# Altium project buck-boost.PrjPcb
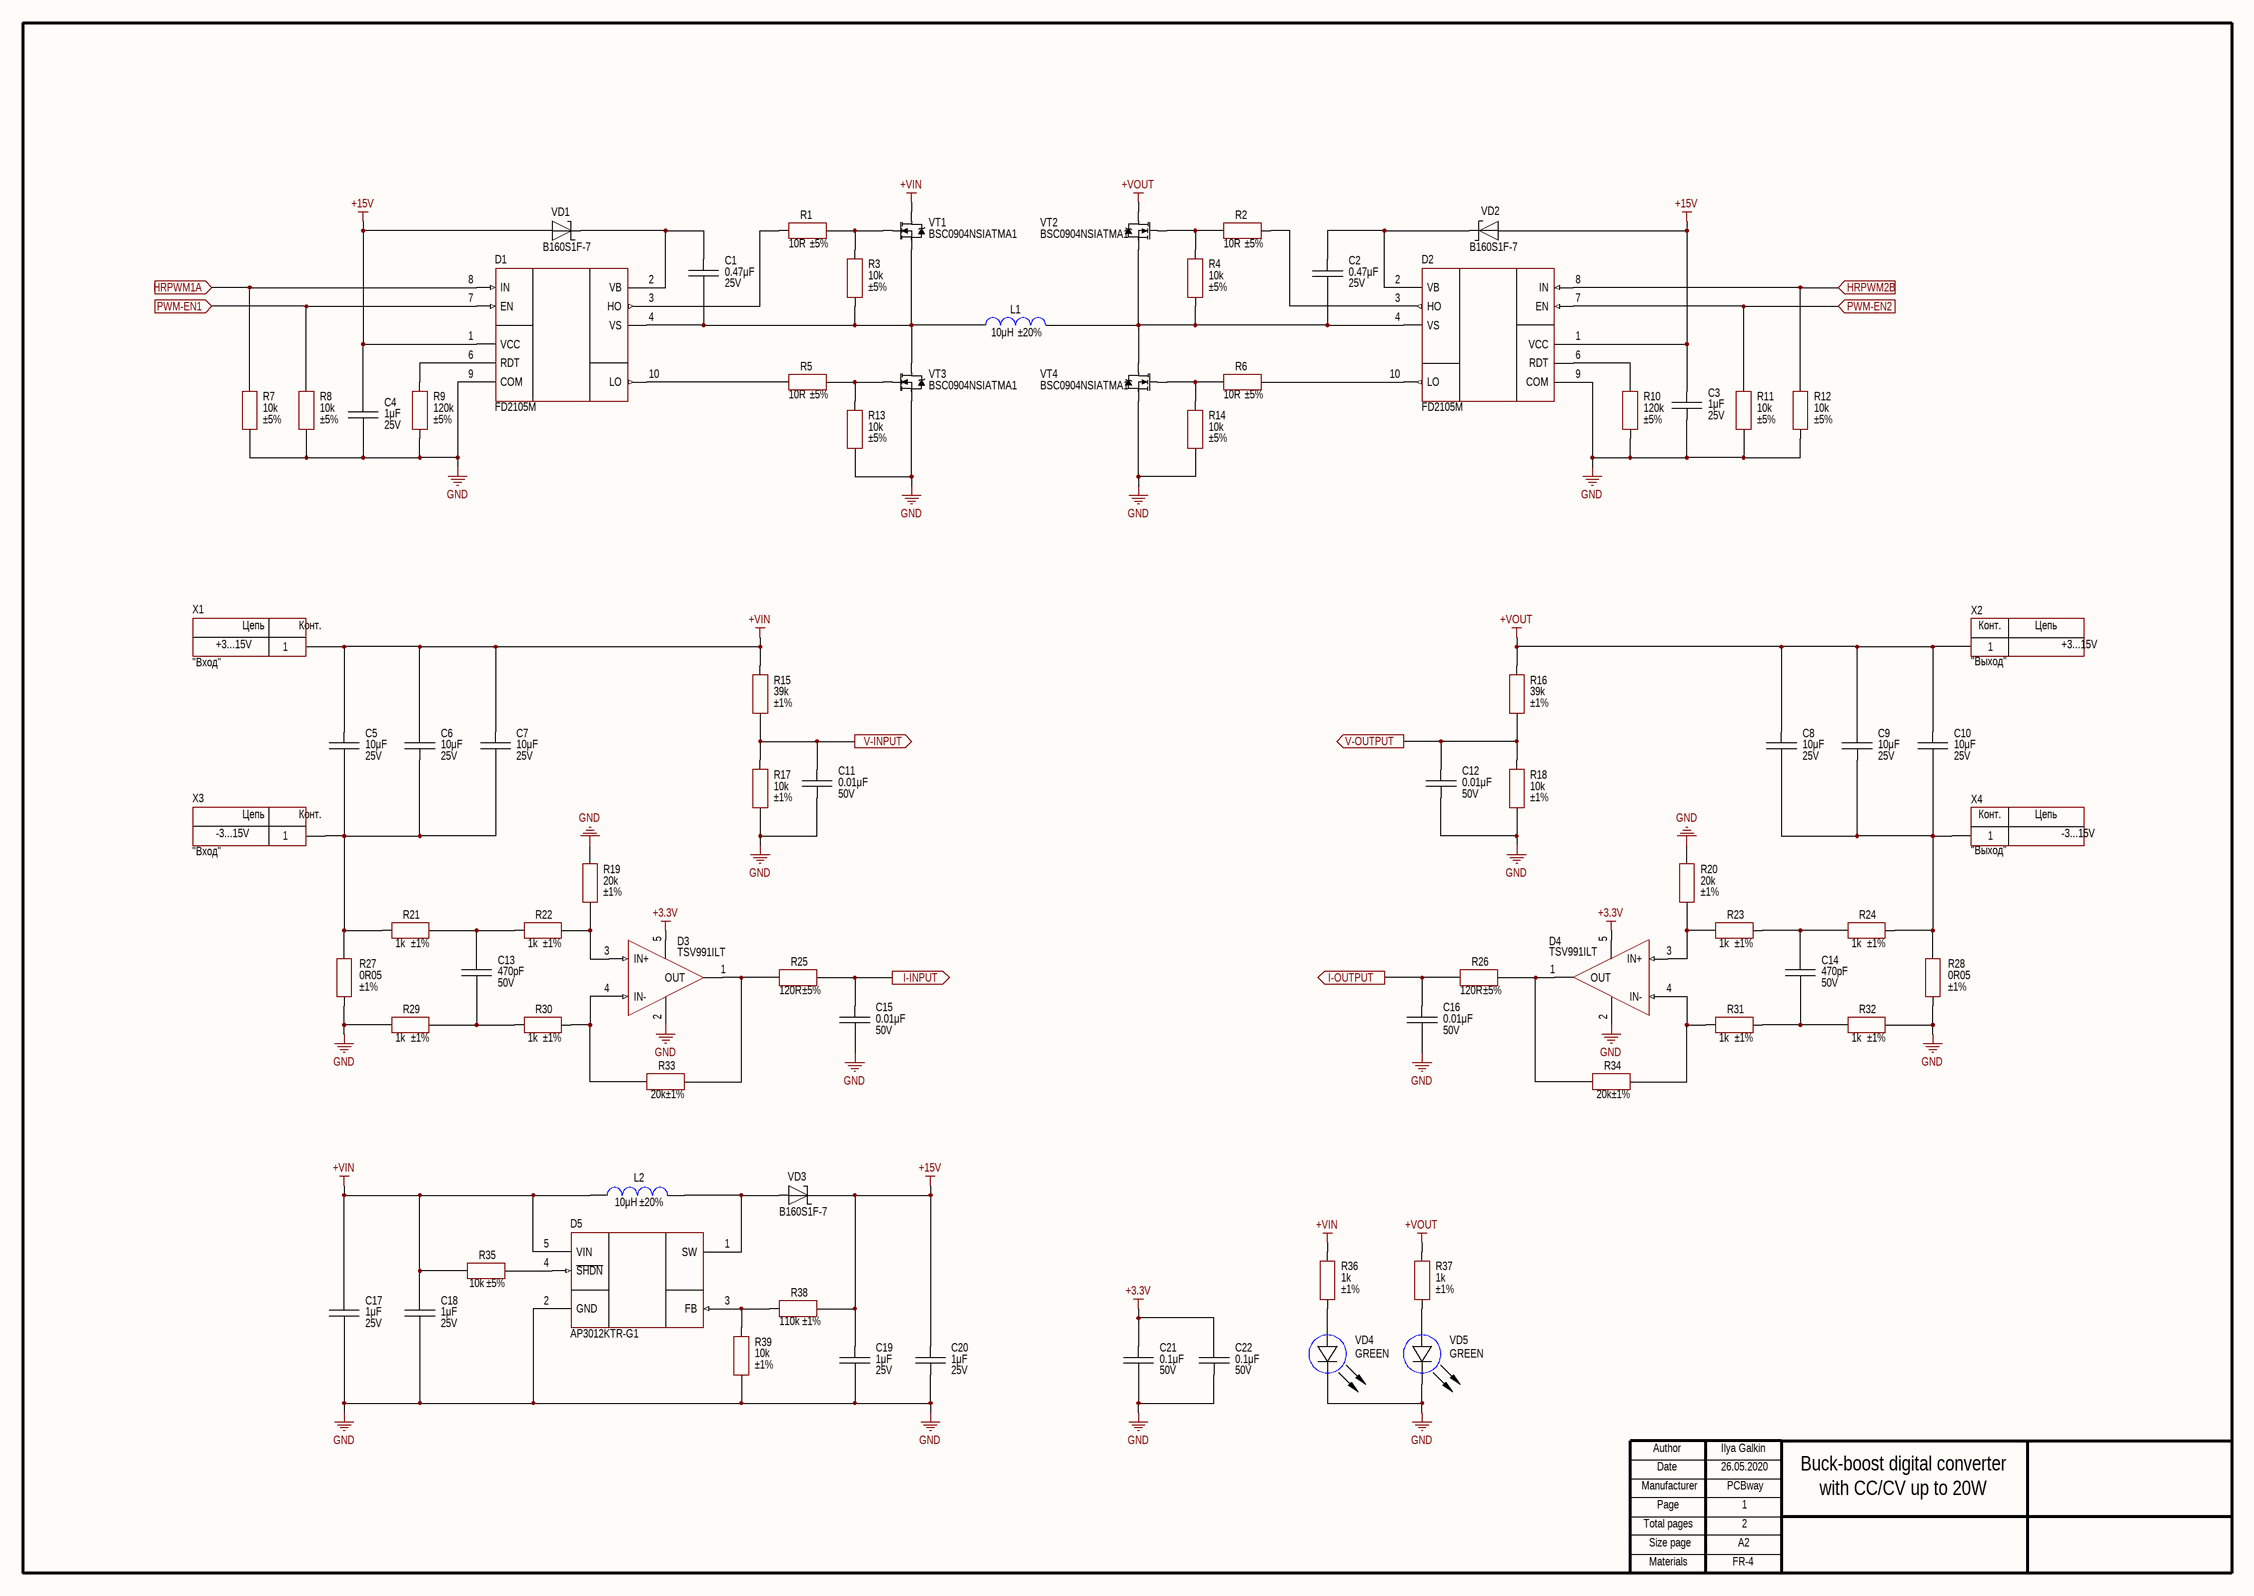
[diagram p0: converter.SchDoc]
1 sheet, 81 parts. Net scope: flat (ports and power ports of the same name join across sheets).
Board file: pcb.PcbDoc

## Sheet converter.SchDoc
size 594 x 420 mm; Address1: Address1; Address2: Address2; Address3: Address3; Address4: Address4; DocumentNumber: АБВГ.123456.001 Э3; SheetNumber: 1; SheetTotal: 2; Scale: 1:1; DocumentType: Схема электрическая принципиальная; FirstReferrence: АБВГ.123456.001

### Parts
C1  value 0.47μF  Voltage: 25V  [CAP: 0805]
C2  value 0.47μF  Voltage: 25V  [CAP: 0805]
C3  value 1μF  Voltage: 25V  [CAP: 0603]
C4  value 1μF  Voltage: 25V  [CAP: 0603]
C5  value 10μF  Voltage: 25V  [CAP: 1210]
C6  value 10μF  Voltage: 25V  [CAP: 1210]
C7  value 10μF  Voltage: 25V  [CAP: 1210]
C8  value 10μF  Voltage: 25V  [CAP: 1210]
C9  value 10μF  Voltage: 25V  [CAP: 1210]
C10  value 10μF  Voltage: 25V  [CAP: 1210]
C11  value 0.01μF  Voltage: 50V  [CAP: 0603]
C12  value 0.01μF  Voltage: 50V  [CAP: 0603]
C13  value 470pF  Voltage: 50V  [CAP: 0603]
C14  value 470pF  Voltage: 50V  [CAP: 0603]
C15  value 0.01μF  Voltage: 50V  [CAP: 0603]
C16  value 0.01μF  Voltage: 50V  [CAP: 0603]
C17  value 1μF  Voltage: 25V  [CAP: 0603]
C18  value 1μF  Voltage: 25V  [CAP: 0603]
C19  value 1μF  Voltage: 25V  [CAP: 0603]
C20  value 1μF  Voltage: 25V  [CAP: 0603]
C21  value 0.1μF  Voltage: 50V  [CAP: 0603]
C22  value 0.1μF  Voltage: 50V  [CAP: 0603]
D1  (no value)  [10-TSSOP]
D2  (no value)  [10-TSSOP]
D3  (no value)  [SOT23-5]
D4  (no value)  [SOT23-5]
D5  (no value)  [SOT23-5]
L1  value 10μH  Tolerance: ±20%  [IND: SRP1038C]
L2  value 10μH  Tolerance: ±20%  [IND: SDR0403]
R1  value 10R  Tolerance: ±5%  [RES: 0603]
R2  value 10R  Tolerance: ±5%  [RES: 0603]
R3  value 10k  Tolerance: ±5%  [RES: 0603]
R4  value 10k  Tolerance: ±5%  [RES: 0603]
R5  value 10R  Tolerance: ±5%  [RES: 0603]
R6  value 10R  Tolerance: ±5%  [RES: 0603]
R7  value 10k  Tolerance: ±5%  [RES: 0603]
R8  value 10k  Tolerance: ±5%  [RES: 0603]
R9  value 120k  Tolerance: ±5%  [RES: 0603]
R10  value 120k  Tolerance: ±5%  [RES: 0603]
R11  value 10k  Tolerance: ±5%  [RES: 0603]
R12  value 10k  Tolerance: ±5%  [RES: 0603]
R13  value 10k  Tolerance: ±5%  [RES: 0603]
R14  value 10k  Tolerance: ±5%  [RES: 0603]
R15  value 39k  Tolerance: ±1%  [RES: 0603]
R16  value 39k  Tolerance: ±1%  [RES: 0603]
R17  value 10k  Tolerance: ±1%  [RES: 0603]
R18  value 10k  Tolerance: ±1%  [RES: 0603]
R19  value 20k  Tolerance: ±1%  [RES: 0603]
R20  value 20k  Tolerance: ±1%  [RES: 0603]
R21  value 1k  Tolerance: ±1%  [RES: 0603]
R22  value 1k  Tolerance: ±1%  [RES: 0603]
R23  value 1k  Tolerance: ±1%  [RES: 0603]
R24  value 1k  Tolerance: ±1%  [RES: 0603]
R25  value 120R  Tolerance: ±5%  [RES: 0603]
R26  value 120R  Tolerance: ±5%  [RES: 0603]
R27  value 0R05  Tolerance: ±1%  [RES: CSS2H (2512)]
R28  value 0R05  Tolerance: ±1%  [RES: CSS2H (2512)]
R29  value 1k  Tolerance: ±1%  [RES: 0603]
R30  value 1k  Tolerance: ±1%  [RES: 0603]
R31  value 1k  Tolerance: ±1%  [RES: 0603]
R32  value 1k  Tolerance: ±1%  [RES: 0603]
R33  value 20k  Tolerance: ±1%  [RES: 0603]
R34  value 20k  Tolerance: ±1%  [RES: 0603]
R35  value 10k  Tolerance: ±5%  [RES: 0603]
R36  value 1k  Tolerance: ±1%  [RES: 0603]
R37  value 1k  Tolerance: ±1%  [RES: 0603]
R38  value 110k  Tolerance: ±1%  [RES: 0603]
R39  value 10k  Tolerance: ±1%  [RES: 0603]
VD1  PartNumber: B160S1F-7  [DIODE: SOD123F]
VD2  PartNumber: B160S1F-7  [DIODE: SOD123F]
VD3  PartNumber: B160S1F-7  [DIODE: SOD123F]
VD4  Color: GREEN  [LED: 0603G]
VD5  Color: GREEN  [LED: 0603G]
VT1  PartNumber: BSC0904NSIATMA1  [8-TDSON]
VT2  PartNumber: BSC0904NSIATMA1  [8-TDSON]
VT3  PartNumber: BSC0904NSIATMA1  [8-TDSON]
VT4  PartNumber: BSC0904NSIATMA1  [8-TDSON]
X1  CommentText: "Вход"  [CON: 8191]
X2  CommentText: "Выход"  [CON: 8191]
X3  CommentText: "Вход"  [CON: 8191]
X4  CommentText: "Выход"  [CON: 8191]

### Ports
HRPWM1A (in), HRPWM2B (in), I-INPUT (out), I-OUTPUT (out), PWM-EN1 (in), PWM-EN2 (in), V-INPUT (out), V-OUTPUT (out)

### Nets
+3.3V: C21.2 C22.2 D3.5(V+) D4.5(V+)
+15V: C3.2 C4.2 C19.2 C20.2 D1.1(VCC) D2.1(VCC) R38.1 VD1.1 VD2.1 VD3.2
+VIN: C5.2 C6.2 C7.2 C17.2 C18.2 D5.5(VIN) L2.2 R15.2 R35.2 R36.2 VT1.2(D) X1.1
+VOUT: C8.2 C9.2 C10.2 R16.2 R37.2 VT2.2(D) X2.1
GND: C3.1 C4.1 C11.1 C12.1 C15.1 C16.1 C17.1 C18.1 C19.1 C20.1 C21.1 C22.1 D1.9(COM) D2.9(COM) D3.2(V-) D4.2(V-) D5.2(GND) R7.1 R8.1 R9.1 R10.1 R11.1 R12.1 R13.1 R14.1 R17.1 R18.1 R19.2 R20.2 R27.1 R28.1 R29.1 R32.2 R39.1 VD4.2(C) VD5.2(C) VT3.3(S) VT4.3(S)
NetC1_1: C1.1 D1.4(VS) L1.2 R3.1 VT1.3(S) VT3.2(D)
NetC1_2: C1.2 D1.2(VB) VD1.2
NetC2_1: C2.1 D2.4(VS) L1.1 R4.1 VT2.3(S) VT4.2(D)
NetC2_2: C2.2 D2.2(VB) VD2.2
NetC5_1: C5.1 C6.1 C7.1 R21.1 R27.2 X3.1
NetC8_1: C8.1 C9.1 C10.1 R24.2 R28.2 X4.1
NetC11_2: C11.2 R15.1 R17.2 ; port V-INPUT
NetC12_2: C12.2 R16.1 R18.2 ; port V-OUTPUT
NetC13_1: C13.1 R29.2 R30.1
NetC13_2: C13.2 R21.2 R22.1
NetC14_1: C14.1 R31.2 R32.1
NetC14_2: C14.2 R23.2 R24.1
NetC15_2: C15.2 R25.2 ; port I-INPUT
NetC16_2: C16.2 R26.1 ; port I-OUTPUT
NetD1_3: D1.3(HO) R1.1
NetD1_6: D1.6(RDT) R9.2
NetD1_7: D1.7(EN) R8.2 ; port PWM-EN1
NetD1_8: D1.8(IN) R7.2 ; port HRPWM1A
NetD1_10: D1.10(LO) R5.1
NetD2_3: D2.3(HO) R2.2
NetD2_6: D2.6(RDT) R10.2
NetD2_7: D2.7(EN) R11.2 ; port PWM-EN2
NetD2_8: D2.8(IN) R12.2 ; port HRPWM2B
NetD2_10: D2.10(LO) R6.2
NetD3_1: D3.1(OUT) R25.1 R33.2
NetD3_3: D3.3(IN+) R19.1 R22.2
NetD3_4: D3.4(IN-) R30.2 R33.1
NetD4_1: D4.1(OUT) R26.2 R34.1
NetD4_3: D4.3(IN+) R20.1 R23.1
NetD4_4: D4.4(IN-) R31.1 R34.2
NetD5_1: D5.1(SW) L2.1 VD3.1
NetD5_3: D5.3(FB) R38.2 R39.2
NetD5_4: D5.4(~{SHDN}) R35.1
NetR1_2: R1.2 R3.2 VT1.1(G)
NetR2_1: R2.1 R4.2 VT2.1(G)
NetR5_2: R5.2 R13.2 VT3.1(G)
NetR6_1: R6.1 R14.2 VT4.1(G)
NetR36_1: R36.1 VD4.1(A)
NetR37_1: R37.1 VD5.1(A)

### Notes on the sheet
- +3...15V
- -3...15V
- Ilya Galkin
- 26.05.2020
- PCBway
- 1
- Buck-boost digital converter
- with CC/CV up to 20W
- 2
- FR-4
- Author
- Manufacturer
- Date
- Page
- Total pages
- Size page
- A2
- Materials
- (in symbol Connector_single_power) Цепь; Конт.

### Library data of the parts
C1 C2 = Ceramic_0805: Manufacturer: Samsung; PartNumber: CL21B474KAFNNNG; ValueManufacturerPartNumber: Ceramic capacitor, 0.47μF, X7R, ±10%, 25V, 0805, -55...+125°C; TypeCapacitor: Ceramic capacitor; Tolerance: ±10%; TypeDielectric: X7R; Package: 0805; HelpURL: https://www.digikey.com/product-detail/en/samsung-electro-mechanics/CL21B474KAFNNNG/1276-6480-1-ND/5958108; Temperature: -55...+125°C
C3 C4 C17-C20 = Ceramic_0603: Manufacturer: Samsung; PartNumber: CL10B105KA8NNNC; ValueManufacturerPartNumber: Ceramic capacitor, 1μF, X7R, ±10%, 25V, 0603, -55...+125°C; TypeCapacitor: Ceramic capacitor; Tolerance: ±10%; TypeDielectric: X7R; Package: 0603; HelpURL: https://www.digikey.com/product-detail/en/samsung-electro-mechanics/CL10B105KA8NNNC/1276-1184-1-ND/3889270; Temperature: -55...+125°C
C5-C10 = Ceramic_1210: Manufacturer: Samsung; PartNumber: CL32B106KAJNNNE; ValueManufacturerPartNumber: Ceramic capacitor, 10μF, X7R, ±10%, 25V, 1210, -55...+125°C; TypeCapacitor: Ceramic capacitor; Tolerance: ±10%; TypeDielectric: X7R; Package: 1210; HelpURL: https://www.digikey.com/product-detail/en/samsung-electro-mechanics/CL32B106KAJNNNE/1276-1807-1-ND/3889893; Temperature: -55...+125°C
C11 C12 C15 C16 = Ceramic_0603: Manufacturer: Yageo; PartNumber: CL10B103KB8NNNC; ValueManufacturerPartNumber: Ceramic capacitor, 0.01μF, X7R, ±10%, 50V, 0603, -55...+125°C; TypeCapacitor: Ceramic capacitor; Tolerance: ±10%; TypeDielectric: X7R; Package: 0603; HelpURL: https://www.digikey.com/product-detail/en/samsung-electro-mechanics/CL10B103KB8NNNC/1276-1009-1-ND/3889095; Temperature: -55...+125°C
C13 C14 = Ceramic_0603: Manufacturer: Yageo; PartNumber: CL10C471JB8NNNC; ValueManufacturerPartNumber: Ceramic capacitor, 470pF, NPO, ±5%, 50V, 0603, -55...+125°C; TypeCapacitor: Ceramic capacitor; Tolerance: ±5%; TypeDielectric: NPO; Package: 0603; HelpURL: https://www.digikey.com/product-detail/en/samsung-electro-mechanics/CL10C471JB8NNNC/1276-1168-1-ND/3889254; Temperature: -55...+125°C
C21 C22 = Ceramic_0603: Manufacturer: Yageo; PartNumber: CL10B104KB8WPND; ValueManufacturerPartNumber: Ceramic capacitor, 0.1μF, X7R, ±10%, 50V, 0603, -55...+125°C; TypeCapacitor: Ceramic capacitor; Tolerance: ±10%; TypeDielectric: X7R; Package: 0603; HelpURL: https://www.digikey.com/product-detail/en/samsung-electro-mechanics/CL10B104KB8WPND/1276-CL10B104KB8WPNDCT-ND/11488014; Temperature: -55...+125°C
D1 D2 = FD2105M: Gate driver; Manufacturer: Fortior Tech; ValueManufacturerPartNumber: Half-bridge gate driver, 40V, +1.2A/-1.8A, Complementary, supply 3...21V, -40...+125°C, 10-MSOP; VoltageSupply: supply 3...21V; Frequency: 40V; CurrentOutput: +1.2A/-1.8A; CMTI: Complementary; HelpURL: https://lcsc.com/product-detail/Others_Fortior-Tech-FD2105M_C328452.html; Package: 10-MSOP; ComponentType: Half-bridge gate driver; Temperature: -40...+125°C; PartNumber: FD2105M
D3 D4 = TSV991ILT: OP amplifier; Manufacturer: STMicroelectronics; ValueManufacturerPartNumber: IC op amplifier, Rail-to-Rail, 20 MHz, 2.7...5.5V, -40...+125°C, SOT23-5; Supply: 2.7...5.5V; OutputType: Rail-to-Rail; GainBandwidth: 20 MHz; HelpURL: https://www.digikey.com/product-detail/en/stmicroelectronics/TSV991ILT/497-6001-1-ND/1578484; Package: SOT23-5; ComponentType: IC op amplifier; Temperature: -40...+125°C; PartNumber: TSV991ILT
D5 = AP3012KTR-G1: Boost converter; Manufacturer: Diodes Incorporated; ValueManufacturerPartNumber: DC/DC boost converter, input 2.6...16V, 1.5MHz, output 3...29V, 0.5A, -40...+85°C, SOT23-5; VoltageInput: input 2.6...16V; Frequency: 1.5MHz; CurrentOutput: 0.5A; VoltageOutput: output 3...29V; HelpURL: https://www.digikey.com/product-detail/en/diodes-incorporated/AP3012KTR-G1/AP3012KTR-G1DICT-ND/4505297; Package: SOT23-5; ComponentType: DC/DC boost converter; Temperature: -40...+85°C; PartNumber: AP3012KTR-G1
L1 = Inductor_SRP1038C: Manufacturer: Bourns; PartNumber: SRP1038C-100M; ValueManufacturerPartNumber: Fixed inductor, 10μH, ±20%, SRP1038C, 8.5A, -40...+125°C; TypeInductor: Fixed inductor; MaxCurrent: 8.5A; Package: SRP1038C; HelpURL: https://www.digikey.com/product-detail/en/bourns-inc/SRP1038C-100M/SRP1038C-100MCT-ND/10249149; Temperature: -40...+125°C
L2 = Inductor_SDR0403: Manufacturer: Bourns; PartNumber: SDR0403-100ML; ValueManufacturerPartNumber: Fixed inductor, 10μH, ±20%, SDR0403, 1.15A, -40...+125°C; TypeInductor: Fixed inductor; MaxCurrent: 1.15A; Package: SDR0403; HelpURL: https://www.digikey.com/product-detail/en/bourns-inc/SDR0403-100ML/SDR0403-100MLCT-ND/2127080; Temperature: -40...+125°C
R1 R2 R5 R6 = Resistor_0603: Manufacturer: Yageo; PartNumber: RC0603JR-0710RL; ValueManufacturerPartNumber: Resistor film, 10R, ±5%, 0603, 0.1W, -55...+125°C; TypeResistor: Resistor film; Power: 0.1W; Package: 0603; HelpURL: https://www.digikey.com/product-detail/en/yageo/RC0603JR-0710RL/311-10GRCT-ND/729646; Temperature: -55...+125°C
R3 R4 R7 R8 R11-R14 R35 = Resistor_0603: Manufacturer: Yageo; PartNumber: RC0603JR-0710KL; ValueManufacturerPartNumber: Resistor film, 10k, ±5%, 0603, 0.1W, -55...+125°C; TypeResistor: Resistor film; Power: 0.1W; Package: 0603; HelpURL: https://www.digikey.com/product-detail/en/yageo/RC0603JR-0710KL/311-10KGRCT-ND/729647; Temperature: -55...+125°C
R9 R10 = Resistor_0603: Manufacturer: Yageo; PartNumber: RC0603JR-07120KL; ValueManufacturerPartNumber: Resistor film, 120k, ±5%, 0603, 0.1W, -55...+125°C; TypeResistor: Resistor film; Power: 0.1W; Package: 0603; HelpURL: https://www.digikey.com/product-detail/en/yageo/RC0603JR-07120KL/311-120KGRCT-ND/729654; Temperature: -55...+125°C
R15 R16 = Resistor_0603: Manufacturer: Yageo; PartNumber: RC0603FR-0739KL; ValueManufacturerPartNumber: Resistor film, 39k, ±1%, 0603, 0.1W, -55...+125°C; TypeResistor: Resistor film; Power: 0.1W; Package: 0603; HelpURL: https://www.digikey.com/product-detail/en/yageo/RC0603FR-0739KL/311-39-0KHRCT-ND/730142; Temperature: -55...+125°C
R17 R18 R39 = Resistor_0603: Manufacturer: Yageo; PartNumber: RC0603FR-0710KL; ValueManufacturerPartNumber: Resistor film, 10k, ±1%, 0603, 0.1W, -55...+125°C; TypeResistor: Resistor film; Power: 0.1W; Package: 0603; HelpURL: https://www.digikey.com/product-detail/en/yageo/RC0603FR-0710KL/311-10-0KHRCT-ND/729827; Temperature: -55...+125°C
R19 R20 R33 R34 = Resistor_0603: Manufacturer: Yageo; PartNumber: RC0603FR-0720KL; ValueManufacturerPartNumber: Resistor film, 20k, ±1%, 0603, 0.1W, -55...+125°C; TypeResistor: Resistor film; Power: 0.1W; Package: 0603; HelpURL: https://www.digikey.com/product-detail/en/yageo/RC0603FR-0720KL/311-20-0KHRCT-ND/729987; Temperature: -55...+125°C
R21-R24 R29-R32 R36 R37 = Resistor_0603: Manufacturer: Yageo; PartNumber: RC0603FR-071KL; ValueManufacturerPartNumber: Resistor film, 1k, ±1%, 0603, 0.1W, -55...+125°C; TypeResistor: Resistor film; Power: 0.1W; Package: 0603; HelpURL: https://www.digikey.com/product-detail/en/yageo/RC0603FR-071KL/311-1-00KHRCT-ND/729790; Temperature: -55...+125°C
R25 R26 = Resistor_0603: Manufacturer: Yageo; PartNumber: RC0603JR-07120RL; ValueManufacturerPartNumber: Resistor film, 120R, ±5%, 0603, 0.1W, -55...+125°C; TypeResistor: Resistor film; Power: 0.1W; Package: 0603; HelpURL: https://www.digikey.com/product-detail/en/yageo/RC0603JR-07120RL/311-120GRCT-ND/729653; Temperature: -55...+125°C
R27 R28 = Shunt: Manufacturer: Bourns; PartNumber: CRA2512-FZ-R050ELF; ValueManufacturerPartNumber: Resistor film, 0R05, ±1%, 2512, 3W, -55...+170°C; TypeResistor: Resistor film; Power: 3W; Package: 2512; HelpURL: https://www.digikey.com/product-detail/en/bourns-inc/CRA2512-FZ-R050ELF/CRA2512-FZ-R050ELFCT-ND/1775057; Temperature: -55...+170°C
R38 = Resistor_0603: Manufacturer: Yageo; PartNumber: RC0603FR-07110KL; ValueManufacturerPartNumber: Resistor film, 110k, ±1%, 0603, 0.1W, -55...+125°C; TypeResistor: Resistor film; Power: 0.1W; Package: 0603; HelpURL: https://www.digikey.com/product-detail/en/yageo/RC0603FR-07110KL/311-110KHRCT-ND/729852; Temperature: -55...+125°C
VD1-VD3 = Schottky_single: Manufacturer: Diodes Incorporated; ValueManufacturerPartNumber: Schottky diode, 60B160S1F-7, 1A, 650mV, 45pF, SOD-123F, -55...+150°C; TypeDiode: Schottky diode; Voltage: 60B160S1F-7; Current: 1A; VoltageDrop: 650mV; RecoveryTime: 45pF; Package: SOD-123F; HelpURL: https://www.digikey.com/product-detail/en/diodes-incorporated/B160S1F-7/B160S1F-7DICT-ND/7784161; Temperature: -55...+150°C
VD4 VD5 = LED_single: Manufacturer: Wurth; ValueManufacturerPartNumber: LED, 20mA, 2V, 0603, -55...+150°C; PartNumber: 150060VS75000; TypeDiode: LED; Current: 20mA; VoltageDrop: 2V; Package: 0603; HelpURL: https://www.digikey.com/product-detail/en/w-rth-elektronik/150060VS75000/732-4980-1-ND/4489904; Temperature: -55...+150°C
VT1-VT4 = MOSFET_N_123: Manufacturer: Infineon Technologies; ValueManufacturerPartNumber: MOSFET N-channel transistor, 30V, 20A, 17nC, 2.5W, 3.7mOhm, 1100pF, 8-TDSON, -55...+150°C; TypeTransistor: MOSFET N-channel transistor; VoltageDS: 30V; CurrentDS: 20A; RDS: 3.7mOhm; GateCharge: 17nC; InputCapacitor: 1100pF; MaxPower: 2.5W; Package: 8-TDSON; HelpURL: https://www.digikey.com/product-detail/en/infineon-technologies/BSC0904NSIATMA1/BSC0904NSIATMA1CT-ND/3196475; Temperature: -55...+150°C
X1-X4 = Connector_single_power: Manufacturer: Keystone; ValueManufacturerPartNumber: Power connector, 500V, 15A; PartNumber: 8191; TypeConnector: Power connector; VoltageMax: 500V; CurrentMax: 15A; HelpURL: https://ru.mouser.com/ProductDetail/Keystone-Electronics/8191?qs=lQmX4aIt5iAMQ8PQTpZ%2Fwg%3D%3D